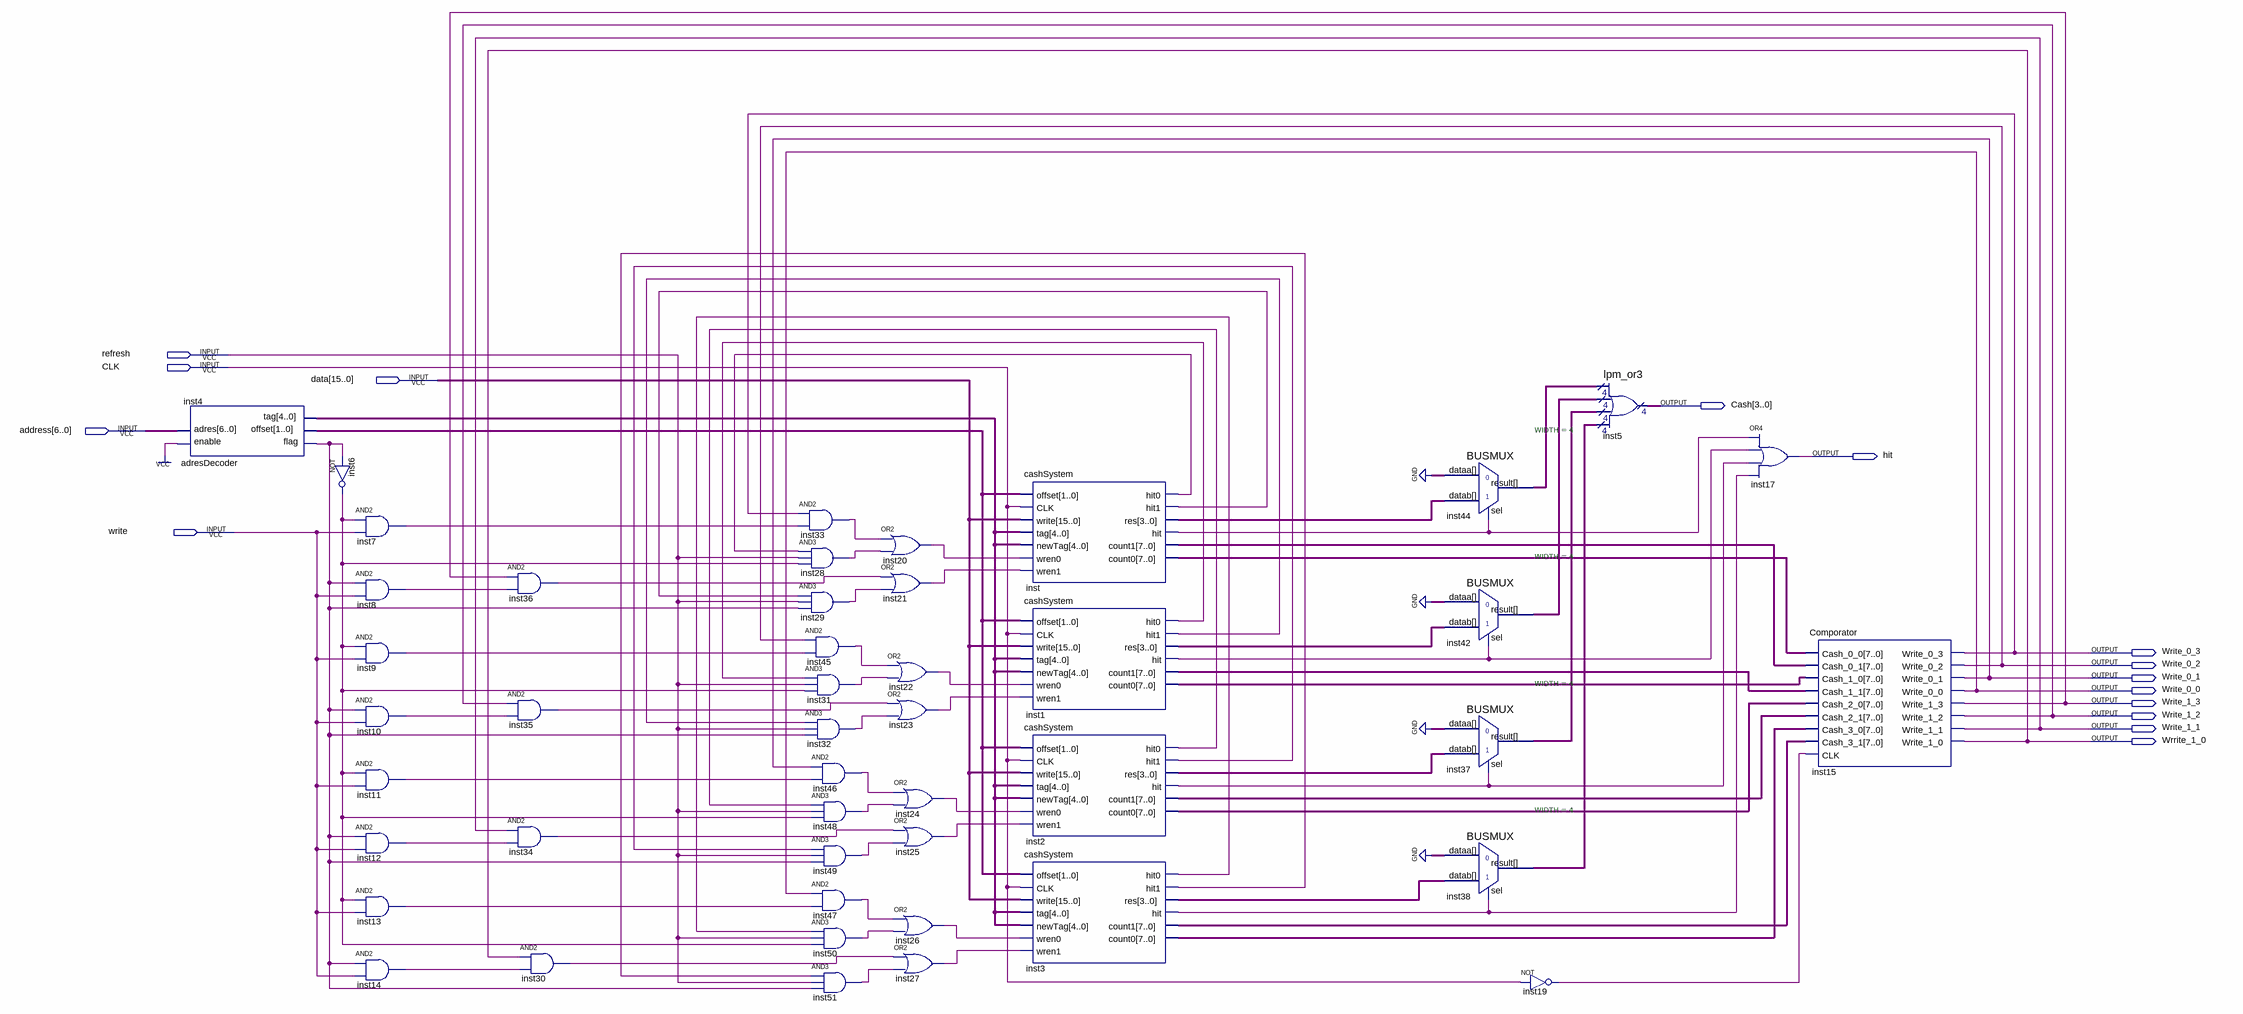
[diagram p0: schematic sheet]
// Quartus schematic System.bdf as structural Verilog: 46 symbols, 15 pins
module System (
  input  refresh,
  input  CLK,
  input  [15:0] data,
  input  [6:0] address,
  input  write,
  output [3:0] Cash,
  output hit,
  output Write_0_3,
  output Write_0_2,
  output Write_0_1,
  output Write_0_0,
  output Write_1_3,
  output Write_1_2,
  output Write_1_1,
  output Wrrite_1_0
);

  wire inst1_hit, inst1_hit0, inst1_hit1, inst2_hit, inst2_hit0, inst2_hit1, inst3_hit, inst3_hit0,
       inst3_hit1, inst4_flag, inst6_out, inst7_out, inst8_out, inst9_out, inst10_out, inst11_out,
       inst12_out, inst13_out, inst14_out, inst19_out, inst20_out, inst21_out, inst22_out, inst23_out,
       inst24_out, inst25_out, inst26_out, inst27_out, inst28_out, inst29_out, inst30_out, inst31_out,
       inst32_out, inst33_out, inst34_out, inst35_out, inst36_out, inst45_out, inst46_out, inst47_out,
       inst48_out, inst49_out, inst50_out, inst51_out, inst_hit, inst_hit0, inst_hit1;
  wire [1:0] inst4_offset;
  wire [3:0] inst1_res, inst2_res, inst3_res, inst37_result, inst38_result, inst42_result, inst44_result,
       inst_res;
  wire [4:0] inst4_tag;
  wire [7:0] inst1_count0, inst1_count1, inst2_count0, inst2_count1, inst3_count0, inst3_count1, inst_count0,
       inst_count1;

  adresDecoder inst4 (.enable(1'b1), .adres(address), .flag(inst4_flag), .offset(inst4_offset), .tag(inst4_tag));
  not inst6 (inst6_out, inst4_flag);
  and inst7 (inst7_out, inst6_out, write);
  and inst8 (inst8_out, inst4_flag, write);
  and inst9 (inst9_out, inst6_out, write);
  and inst10 (inst10_out, inst4_flag, write);
  and inst11 (inst11_out, inst6_out, write);
  and inst12 (inst12_out, inst4_flag, write);
  and inst13 (inst13_out, inst6_out, write);
  and inst14 (inst14_out, inst4_flag, write);
  and inst36 (inst36_out, Write_1_3, inst8_out);
  and inst35 (inst35_out, Write_1_2, inst10_out);
  and inst34 (inst34_out, Write_1_1, inst12_out);
  and inst30 (inst30_out, Wrrite_1_0, inst14_out);
  and inst33 (inst33_out, Write_0_3, inst7_out);
  and inst28 (inst28_out, inst_hit0, refresh, inst6_out);
  and inst29 (inst29_out, inst_hit1, refresh, inst4_flag);
  and inst45 (inst45_out, Write_0_2, inst9_out);
  and inst31 (inst31_out, inst1_hit0, refresh, inst6_out);
  and inst32 (inst32_out, inst1_hit1, refresh, inst4_flag);
  and inst46 (inst46_out, Write_0_1, inst11_out);
  and inst48 (inst48_out, inst2_hit0, refresh, inst6_out);
  and inst49 (inst49_out, inst2_hit1, refresh, inst4_flag);
  and inst47 (inst47_out, Write_0_0, inst13_out);
  and inst50 (inst50_out, inst3_hit0, refresh, inst6_out);
  and inst51 (inst51_out, inst3_hit1, refresh, inst4_flag);
  or inst20 (inst20_out, inst33_out, inst28_out);
  or inst21 (inst21_out, inst36_out, inst29_out);
  or inst22 (inst22_out, inst45_out, inst31_out);
  or inst23 (inst23_out, inst35_out, inst32_out);
  or inst24 (inst24_out, inst46_out, inst48_out);
  or inst25 (inst25_out, inst34_out, inst49_out);
  or inst26 (inst26_out, inst47_out, inst50_out);
  or inst27 (inst27_out, inst30_out, inst51_out);
  cashSystem inst (
    .offset(inst4_offset), .CLK(CLK), .write(data), .tag(inst4_tag), .newTag(inst4_tag), .wren0(inst20_out),
    .wren1(inst21_out), .hit0(inst_hit0), .hit1(inst_hit1), .res(inst_res), .hit(inst_hit),
    .count1(inst_count1), .count0(inst_count0));
  cashSystem inst1 (
    .offset(inst4_offset), .CLK(CLK), .write(data), .tag(inst4_tag), .newTag(inst4_tag), .wren0(inst22_out),
    .wren1(inst23_out), .hit0(inst1_hit0), .hit1(inst1_hit1), .res(inst1_res), .hit(inst1_hit),
    .count1(inst1_count1), .count0(inst1_count0));
  cashSystem inst2 (
    .offset(inst4_offset), .CLK(CLK), .write(data), .tag(inst4_tag), .newTag(inst4_tag), .wren0(inst24_out),
    .wren1(inst25_out), .hit0(inst2_hit0), .hit1(inst2_hit1), .res(inst2_res), .hit(inst2_hit),
    .count1(inst2_count1), .count0(inst2_count0));
  cashSystem inst3 (
    .offset(inst4_offset), .CLK(CLK), .write(data), .tag(inst4_tag), .newTag(inst4_tag), .wren0(inst26_out),
    .wren1(inst27_out), .hit0(inst3_hit0), .hit1(inst3_hit1), .res(inst3_res), .hit(inst3_hit),
    .count1(inst3_count1), .count0(inst3_count0));
  BUSMUX #(.WIDTH(4)) inst44 (.datab(inst_res), .sel(inst_hit), .dataa(4'b0000), .result(inst44_result));
  BUSMUX #(.WIDTH(4)) inst42 (.datab(inst1_res), .sel(inst1_hit), .dataa(4'b0000), .result(inst42_result));
  BUSMUX #(.WIDTH(4)) inst37 (.datab(inst2_res), .sel(inst2_hit), .dataa(4'b0000), .result(inst37_result));
  BUSMUX #(.WIDTH(4)) inst38 (.datab(inst3_res), .sel(inst3_hit), .dataa(4'b0000), .result(inst38_result));
  not inst19 (inst19_out, CLK);
  lpm_or3 inst5 (
    .data0x(inst44_result), .data1x(inst42_result), .data2x(inst37_result), .data3x(inst38_result),
    .result(Cash));
  or inst17 (hit, inst_hit, inst1_hit, inst2_hit, inst3_hit);
  Comporator inst15 (
    .Cash_0_0(inst_count0), .Cash_0_1(inst_count1), .Cash_1_0(inst1_count0), .Cash_1_1(inst1_count1),
    .Cash_2_0(inst2_count0), .Cash_2_1(inst2_count1), .Cash_3_0(inst3_count0), .Cash_3_1(inst3_count1),
    .CLK(inst19_out), .Write_0_3(Write_0_3), .Write_0_2(Write_0_2), .Write_0_1(Write_0_1),
    .Write_0_0(Write_0_0), .Write_1_3(Write_1_3), .Write_1_2(Write_1_2), .Write_1_1(Write_1_1),
    .Write_1_0(Wrrite_1_0));
endmodule
